# Altium schematic sheet Power_Clock.SchDoc
size A; Author: E. Sims; Organization: Let's Build Rockets Inc.; SheetNumber: 11; SheetTotal: 11
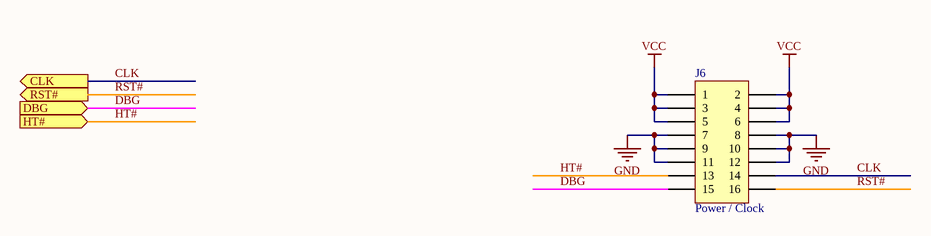
[diagram p0: Power_Clock.SchDoc]

## Parts
J6  Power / Clock  [HDR2X8]

## Ports
CLK (out), DBG (in), HT# (in), RST# (out)

## Nets
GND: J6.7 J6.8 J6.9 J6.10 J6.11 J6.12
VCC: J6.1 J6.2 J6.3 J6.4 J6.5 J6.6
CLK: J6.14 ; port CLK
DBG: J6.15 ; port DBG
HT#: J6.13 ; port HT#
RST#: J6.16 ; port RST#

## Notes on the sheet
- Let's Build Rocket's Inc. Modular Paylaod System Based on TMP-010 Rev
  For more information visit https://github.com/LetsBuildRockets/Modular-Payload-System
  This work is licensed under CC BY-NC 4.0. To view a copy of this license, visit https://creativecommons.org/licenses/by-nc/4.0
- Title
- Size:
- Date:
- Assembly Variant:
- B
- Number:
- Time:
- Revision:
- Sheet
- of
- Author:
- File:

## Library data of the parts
J6 = Header 8X2: Header, 8-Pin, Dual row; System: Connector; LatestRevisionDate: 17-Jul-2002; LatestRevisionNote: Re-released for DXP Platform.; Publisher: Altium Limited